# Altium schematic sheet Power.SchDoc
size A4; SheetNumber: 2; SheetTotal: 5
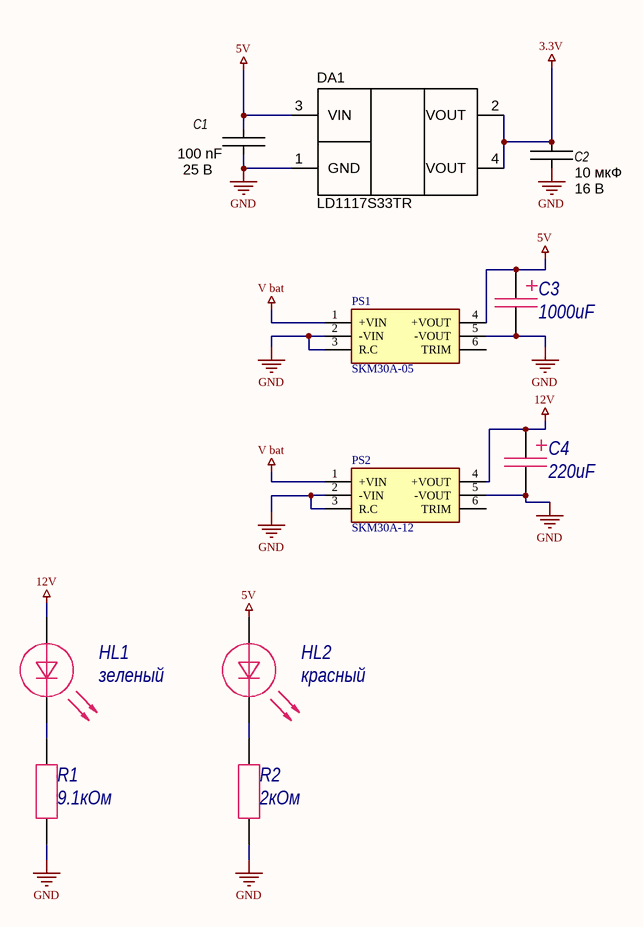
[diagram p0: Power.SchDoc]

## Parts
C1  Voltage: 25 В  [C0402C]  (hidden comment: 100 nF)
C2  Voltage: 16 В  [C0805C]  (hidden comment: 10 мкФ)
C3  value 1000uF  [Capacitor 8x12]  (hidden comment: 1uF)
C4  value 220uF  [Capacitor 8x12]  (hidden comment: 1uF)
DA1  LD1117S33TR  [SOT-223]
HL1  Color: зеленый  [0805D]
HL2  Color: красный  [0805D]
PS1  SKM30A-05  [SKM30A05]
PS2  SKM30A-12  [SKM30B12]
R1  value 9.1кОм  [0805R]  (hidden comment: Resistor)
R2  value 2кОм  [0805R]  (hidden comment: Resistor)

## Nets
3.3V: C2.1 DA1.2(VOUT) DA1.4(VOUT)
5V: C1.1 C3.1 DA1.3(VIN) HL2.1 PS1.4(+VOUT)
12V: C4.1 HL1.1 PS2.4(+VOUT)
GND: C1.2 C2.2 C3.2 C4.2 DA1.1(GND) PS1.2(-VIN) PS1.3(R.C) PS1.5(-VOUT) PS2.2(-VIN) PS2.3(R.C) PS2.5(-VOUT) R1.1 R2.1
V bat: PS1.1(+VIN) PS2.1(+VIN)
NetHL1_2: HL1.2 R1.2
NetHL2_2: HL2.2 R2.2

Not connected (* = marked no-connect by the designer): PS1 6(TRIM); PS2 6(TRIM)

## Library data of the parts
C1 = CL05B103KA5NNNC: SMD 0603 ; X7R; 0,01 мкФ; 25 В; Manufacturer: SAMSUNG; Persent: ±10%; Type: Ceramic; Part Number: CL05B103KA5NNNC; Package: SMD 0402; Dielectric: X7R; ComponentLink1Description: Datasheet; Value: 100 nF
C2 = CL21B106KOQNNNE: SMD 0805; X7R; 10 мкФ; 16 В; Manufacturer: SAMSUNG; Persent: ±15%; Type: Ceramic; Part Number: CL21B106KOQNNNE; Package: SMD 0805; Dielectric: X7R; ComponentLink1Description: Datasheet; Value: 10 мкФ
C3 C4 = Capacitor_pol
DA1 = LD1117S33TR: Linear regulator, 3V3; Manufacturer: STMicroelectronics; Type: Linear regulator; Part Number: LD1117S33TR
HL1 HL2 = LED: Manufacturer: -; Rate: -; Datasheet: -; Shop: -; Notice: -; Case: -
PS1 = SKM30A-05: Power Supply; Manufacturer_Name: Mean Well; Datasheet Link: https://www.meanwell.com/webapp/product/search.aspx?prod=SKM30; Height: 11.2mm; Manufacturer_Part_Number: SKM30A-05; Mouser Part Number: 709-SKM30A-05; Mouser Price/Stock: https://www.mouser.co.uk/ProductDetail/MEAN-WELL/SKM30A-05?qs=WtedIhRlNpsvgfTGPi4UAw%3D%3D
PS2 = SKM30A-12: Power Supply; Manufacturer_Name: Mean Well; Datasheet Link: https://www.meanwell.com/webapp/product/search.aspx?prod=SKM30; Height: 11.2mm; Manufacturer_Part_Number: SKM30A-12; Mouser Part Number: 709-SKM30A-12; Mouser Price/Stock: https://www.mouser.co.uk/ProductDetail/MEAN-WELL/SKM30A-12?qs=WtedIhRlNpuG9wDURm5lSA%3D%3D; Arrow Part Number: SKM30A-12; Arrow Price/Stock: https://www.arrow.com/en/products/skm30a-12/mean-well-enterprises